# Altium project Motor_Controller_3.PrjPcb
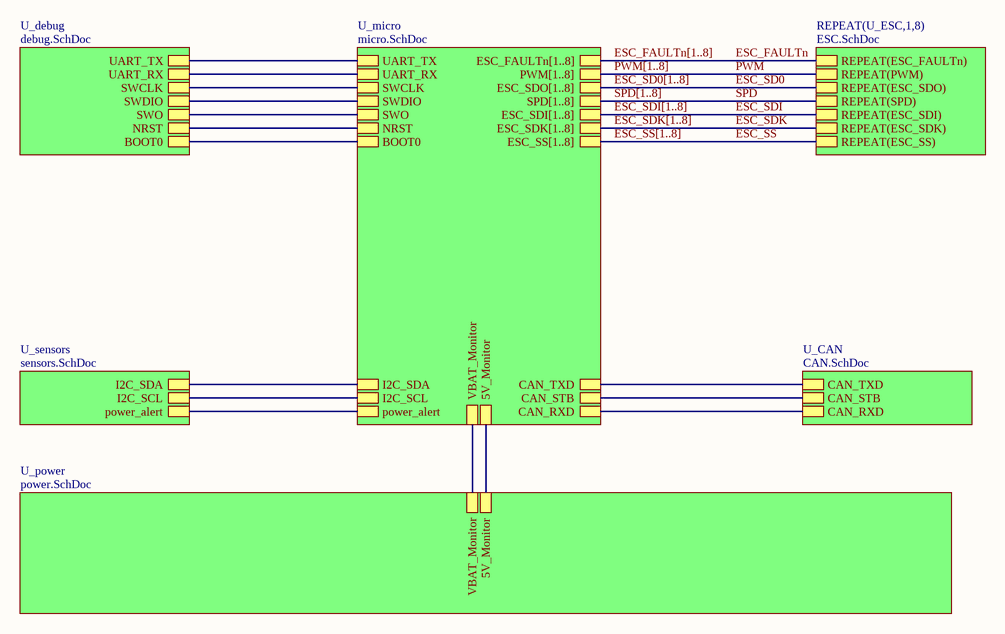
[diagram p0: master.SchDoc]
7 sheets, 320 parts. Net scope: hierarchical (ports join the sheet entries above them; power ports are global).
Board file: motor_controller_3.PcbDoc
Sheets:
  master.SchDoc
    U_CAN = CAN.SchDoc
    U_micro = micro.SchDoc
    U_power = power.SchDoc
    U_sensors = sensors.SchDoc
    U_ESC1 = ESC.SchDoc
    U_ESC2 = ESC.SchDoc
    U_ESC3 = ESC.SchDoc
    U_ESC4 = ESC.SchDoc
    U_ESC5 = ESC.SchDoc
    U_ESC6 = ESC.SchDoc
    U_ESC7 = ESC.SchDoc
    U_ESC8 = ESC.SchDoc
    U_debug = debug.SchDoc

## Sheet master.SchDoc
size A4

### Sub-sheets
REPEAT(U_ESC,1,8) = ESC.SchDoc: REPEAT(ESC_FAULTn), REPEAT(PWM), REPEAT(ESC_SDO), REPEAT(SPD), REPEAT(ESC_SDI), REPEAT(ESC_SDK), REPEAT(ESC_SS)
U_CAN = CAN.SchDoc: CAN_TXD, CAN_STB, CAN_RXD
U_debug = debug.SchDoc: UART_TX, UART_RX, SWCLK, SWDIO, SWO, NRST, BOOT0
U_micro = micro.SchDoc: UART_TX, ESC_SS[1..8], UART_RX, ESC_FAULTn[1..8], SPD[1..8], PWM[1..8], CAN_STB, ESC_SDK[1..8], ESC_SDI[1..8], I2C_SDA, I2C_SCL, CAN_TXD, CAN_RXD, ESC_SDO[1..8], SWO, SWCLK, SWDIO, NRST, BOOT0, power_alert, VBAT_Monitor, 5V_Monitor
U_power = power.SchDoc: VBAT_Monitor, 5V_Monitor
U_sensors = sensors.SchDoc: I2C_SDA, I2C_SCL, power_alert

### Nets
CAN_RX: sheet U_CAN/CAN_RXD, sheet U_micro/CAN_RXD
CAN_TX: sheet U_CAN/CAN_TXD, sheet U_micro/CAN_TXD
ESC_FAULTn: sheet REPEAT(U_ESC,1,8)/REPEAT(ESC_FAULTn)
ESC_SD0: sheet REPEAT(U_ESC,1,8)/REPEAT(ESC_SDO)
ESC_SDI: sheet REPEAT(U_ESC,1,8)/REPEAT(ESC_SDI)
ESC_SDK: sheet REPEAT(U_ESC,1,8)/REPEAT(ESC_SDK)
ESC_SS: sheet REPEAT(U_ESC,1,8)/REPEAT(ESC_SS)
NRST: sheet U_micro/NRST, sheet U_debug/NRST
PWM: sheet REPEAT(U_ESC,1,8)/REPEAT(PWM)
SCL: sheet U_micro/I2C_SCL, sheet U_sensors/I2C_SCL
SDA: sheet U_micro/I2C_SDA, sheet U_sensors/I2C_SDA
SPD: sheet REPEAT(U_ESC,1,8)/REPEAT(SPD)
SWCLK: sheet U_micro/SWCLK, sheet U_debug/SWCLK
SWDIO: sheet U_micro/SWDIO, sheet U_debug/SWDIO
SWO: sheet U_micro/SWO, sheet U_debug/SWO
NetCN3_3: sheet U_micro/UART_TX, sheet U_debug/UART_TX
NetCN3_4: sheet U_micro/UART_RX, sheet U_debug/UART_RX
NetJP3_2: sheet U_micro/BOOT0, sheet U_debug/BOOT0
NetR25_1: sheet U_micro/power_alert, sheet U_sensors/power_alert
NetR31_1: sheet U_micro/VBAT_Monitor, sheet U_power/VBAT_Monitor
NetR32_2: sheet U_micro/5V_Monitor, sheet U_power/5V_Monitor
NetU1_69: sheet U_CAN/CAN_STB, sheet U_micro/CAN_STB

### Buses and harness runs
bus ESC_FAULTn[1..8] = sheet U_micro/ESC_FAULTn[1..8]
bus ESC_SD0[1..8] = sheet U_micro/ESC_SDO[1..8]
bus ESC_SDI[1..8] = sheet U_micro/ESC_SDI[1..8]
bus ESC_SDK[1..8] = sheet U_micro/ESC_SDK[1..8]
bus ESC_SS[1..8] = sheet U_micro/ESC_SS[1..8]
bus PWM[1..8] = sheet U_micro/PWM[1..8]
bus SPD[1..8] = sheet U_micro/SPD[1..8]

## Sheet CAN.SchDoc
size A4
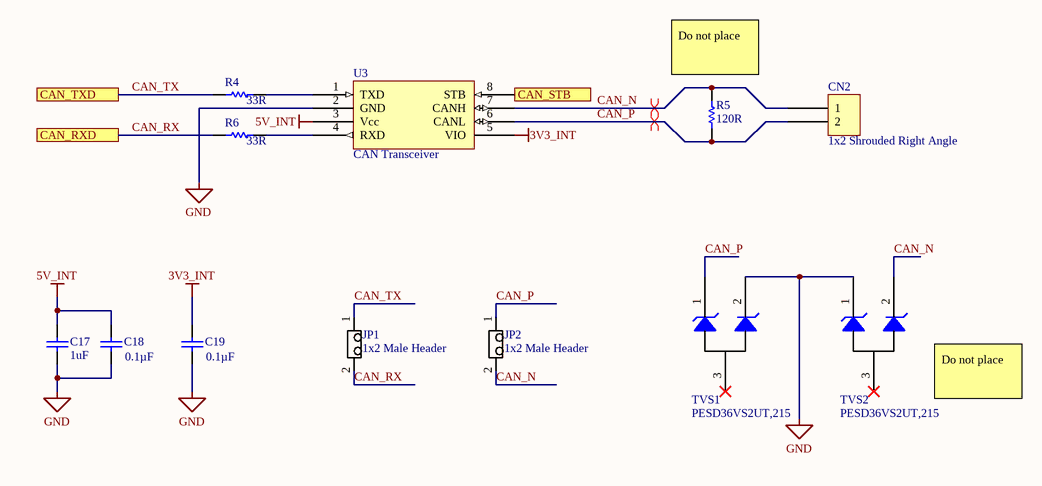
[diagram p1: CAN.SchDoc]

### Parts
C17  Capacitance: 1uF  [0803 CAP]  (hidden comment: CL21B105KBFNNNG)
C18  value 0.1µF  [CAPC2012N(0805")]  (hidden comment: 0.1uF 50V 0805 SMD, Ceramic)
C19  value 0.1µF  [CAPC2012N(0805")]  (hidden comment: 0.1uF 50V 0805 SMD, Ceramic)
CN2  1x2 Shrouded Right Angle  [2X1 Female Header]
JP1  1x2 Male Header  [2X1 Males Header]
JP2  1x2 Male Header  [2X1 Males Header]
R4  33R  [RESC1608X55X25LL10T15]
R5  120R  [RESC1608X55X25LL10T15]
R6  33R  [RESC1608X55X25LL10T15]
TVS1  PESD36VS2UT,215  [SOT95P245X110-3N]
TVS2  PESD36VS2UT,215  [SOT95P245X110-3N]
U3  CAN Transceiver  [8-SOIC]

### Ports
CAN_RXD, CAN_STB, CAN_TXD

### Nets
3V3_INT: C19.2(Cathode) U3.5(VIO)
5V_INT: C17.2 C18.2(Cathode) U3.3(Vcc)
GND: C17.1 C18.1(Anode) C19.1(Anode) TVS1.2(Cathode_2) TVS2.1(Cathode_1) U3.2(GND)
CAN_N: CN2.1 JP2.2 R5.2 TVS2.2(Cathode_2) U3.7(CANH)
CAN_P: CN2.2 JP2.1 R5.1 TVS1.1(Cathode_1) U3.6(CANL)
CAN_RX: JP1.2 R6.1 ; port CAN_RXD
CAN_TX: JP1.1 R4.1 ; port CAN_TXD
NetR4_2: R4.2 U3.1(TXD)
NetR6_2: R6.2 U3.4(RXD)
NetU1_69: U3.8(STB) ; port CAN_STB

Not connected (* = marked no-connect by the designer): TVS1 3(Common_Anode); TVS2 3(Common_Anode)

### Layout directives
differential pair; differential pair; differential pair; differential pair; differential pair: CAN_N
differential pair: CAN_P

### Notes on the sheet
- (near R5) Do not place
- (near TVS2) Do not place

### Library data of the parts
C17 = CMP-00005-3: SAMSUNG ELECTRO-MECHANICS - CL21B105KBFNNNG - MLCC CAPACITORS; Tolerance: 10%; Voltage Rating: 50V; Material: Ceramic; Dielectric: X7R; Case/Package: 0805; Contact Plating: Tin; Max Operating Temperature: 125°C; Termination: Wraparound; Package Quantity: 3000; Depth: 1.25mm; Mount: Surface Mount; Min Operating Temperature: -55°C; Thickness: 0.053inch; Packaging: Tape and Reel; Voltage: 50V; Case Code (Metric): 2012; Length: 2mm; Case Code (Imperial): 0805; Width: 0.049inch
C18 C19 = CMP-006-0006-1: Capacitor, Ceramic, 50V, +/-5%, 0805 SMD, X7R; Source: AUVic_Schematic_Library_Capacitors.SchLib; Component Type: Standard; PackageDescription: Chip Capacitor; Publisher: AUVic; Pin Count: 2; Published: 2016-03-16; Design Item ID: 0.1uF 50V 0805 SMD, Ceramic
CN2 = CMP-00010-3: 02 MTE HDR SRRA LATCH; Connector Type: Plug,Header,Pin; Backwall/Post Interruptions: No (Without); Pitch: 2.54mm; Approvals: CSA; Gender: Male; Contact Resistance: 15mR; PCB Thickness: 0.062inch; Contact Current Rating: 3A; Contact Retention: Yes (With); Number of Contacts: 2; PCB Mount Retention: Without; Insulation Resistance: 5GR; Row Spacing: 0.1inch; Tail Length: 3.3mm; Contact Plating: Gold,Tin,Matte; ELV: Compliant; Height: 13.59mm; Package Quantity: 68; Current Rating: 3A; Mount: Through Hole; Number of Rows: 1; Contact Material: Brass; Max Operating Temperature: 105°C; Lead Free: Lead Free; Mating Alignment: Yes (With); Min Operating Temperature: -65°C; Flammability Rating: UL94 V-0; Mating Retention: Yes (With); Color: Black; Number of Positions: 2; REACH SVHC: Unknown; Contact Mating Length: 0.23inch; Orientation: Right Angle; Packaging: Rail/Tube; Termination: Crimp; PCB Mount Alignment: No (Without); Contact Shape: Square; PCB Mounting Orientation: Right Angle; Housing Color: Black; Depth: 13.59mm; Length: 7.62mm; Contact Gender: Male; Strain Relief: No (Without); Housing Material: Thermoplastic
JP1 JP2 = CMP-004-0001-1: Made By: Andy Bates; Source: AUVic_Schematic_Library_Connectors.SchLib; Pin Count: 2; Design Item ID: 1x2 Male Header; Component Type: Standard
R4 R6 = CMP-00060-1: Res Thick Film 0603 33 Ohm 1% 1/10W +/-100ppm/ßC Molded SMD Paper T/R; Max Power Dissipation: 100mW; Voltage Rating: 75V; Voltage Rating (DC): 50V; Temperature Coefficient: 100ppm/°C; Depth: 0.8mm; Military Standard: Not; Min Operating Temperature: -55°C; Termination: SMD/SMT; Weight: 7.1E-05oz; Number of Terminations: 2; Height: 0.45mm; Power Rating: 100mW; Composition: Thick Film; Length: 1.6mm; Packaging: Tape and Reel; Resistance: 33R; Lead Pitch: 0.3mm; Lead Free: Lead Free; Max Operating Temperature: 155°C; REACH SVHC: No SVHC; Features: Moisture Resistant; Tolerance: 1%; Case/Package: 0603; Package Quantity: 1; Width: 0.8mm; Case Code (Metric): 1608; Number of Pins: 2; Case Code (Imperial): 0603
R5 = CMP-00061-1: Res Thick Film 0603 120 Ohm 1% 0.1W(1/10W) ±100ppm/C Epoxy SMD T/R; Power Rating: 100mW; Voltage Rating (DC): 50V; Temperature Coefficient: 100ppm/°C; Depth: 0.8mm; Max Operating Temperature: 155°C; Case/Package: 0603; Lead Free: Lead Free; Height: 0.022inch; Length: 1.6mm; Case Code (Metric): 1608; Package Quantity: 1; Features: Moisture Resistant; Termination: SMD/SMT; Military Standard: Not; Number of Pins: 2; Width: 0.031inch; REACH SVHC: No SVHC; Max Power Dissipation: 100mW; Min Operating Temperature: -55°C; Resistance: 120R; Packaging: Tape and Reel; Composition: Thick Film; Tolerance: 1%; Voltage Rating: 50V; Number of Terminations: 2; Case Code (Imperial): 0603
TVS1 TVS2 = CMP-058-0000-2: TVS DIODE 36V 60V SOT23; Created By: Miguel Manguerra; Date Created: 2020-05-18; Design Item ID: PESD36VS2UT,215; Component Type: Standard; Pin Count: 3; Source: AUVic_Schematic_Library_Diodes.SchLib
U3 = CMP-032-0000-2: 1/1 Transceiver Half CANbus 8-SO; Data Rate: 1Mbps; Max Supply Voltage: 5.5V; Propagation Delay: 250ns; Number of Transceivers: 1; Nominal Supply Current: 70mA; Min Supply Voltage: 4.5V; Min Operating Temperature: -40°C; Radiation Hardening: No; Packaging: Tape and Reel; Turn-On Delay Time: 250ns; Case/Package: SO; Contact Plating: Gold; Package Quantity: 2500; Number of Pins: 8; Max Supply Current: 70mA; Max Operating Temperature: 150°C; Interface: CAN; Mount: Surface Mount; Lead Free: Lead Free

## Sheet micro.SchDoc
size A4
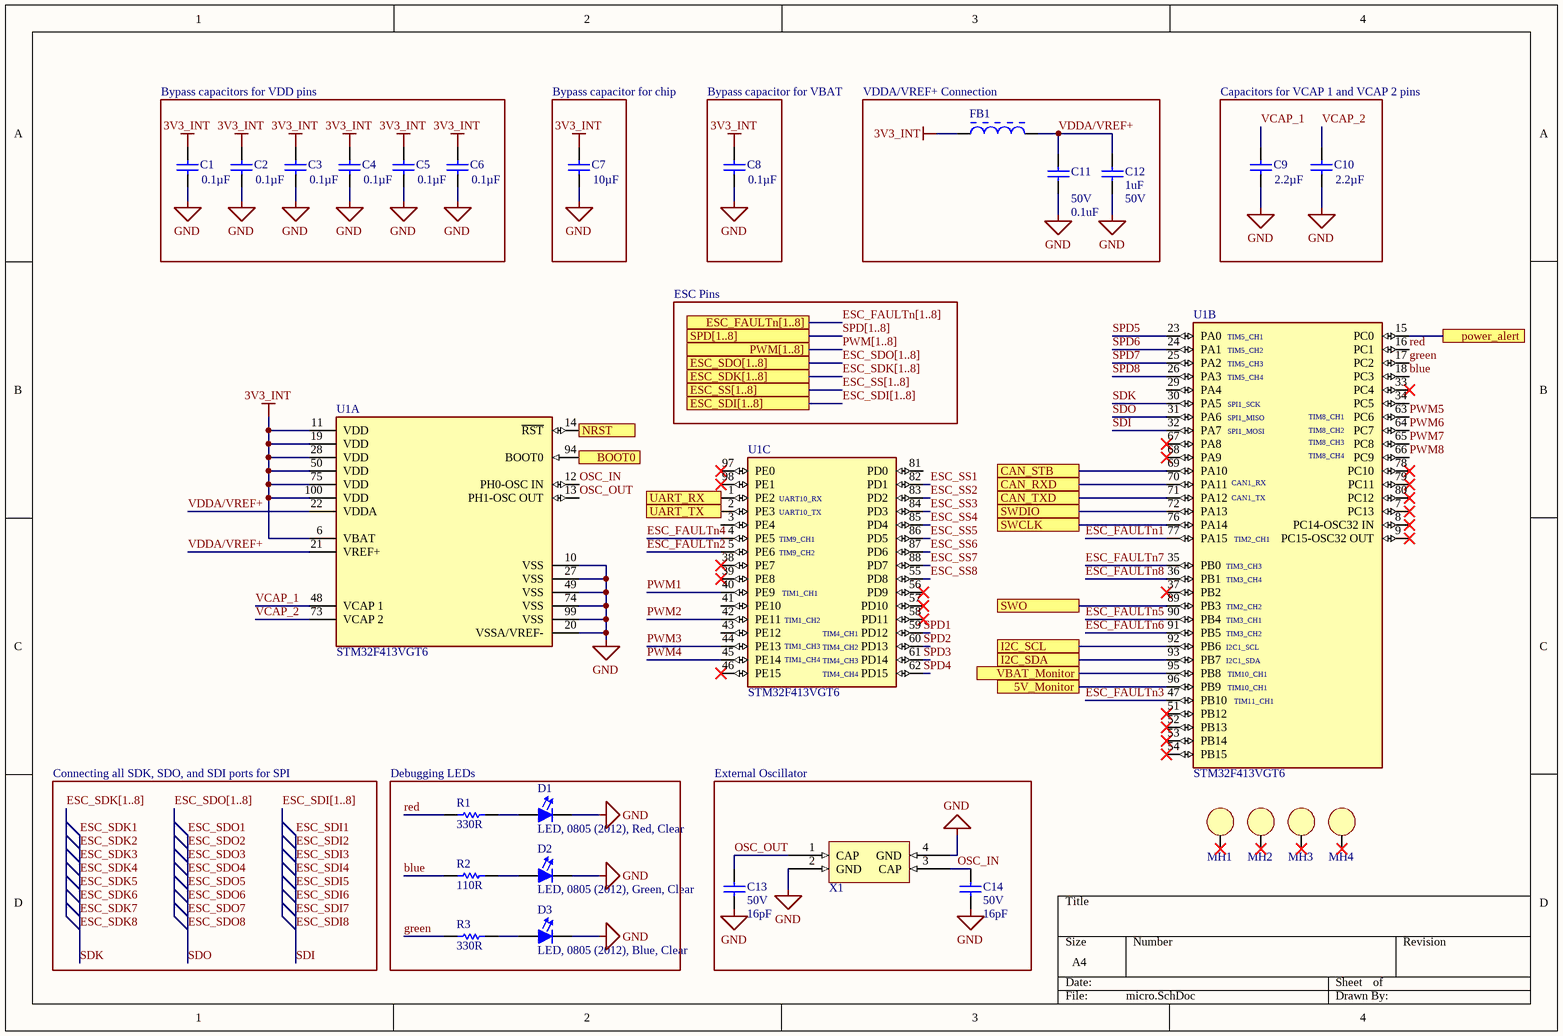
[diagram p2: micro.SchDoc]

### Parts
C1  value 0.1µF  [CAPC1608N(0603")]  (hidden comment: 0.1uF 16V 0603 SMD, Ceramic)
C2  value 0.1µF  [CAPC1608N(0603")]  (hidden comment: 0.1uF 16V 0603 SMD, Ceramic)
C3  value 0.1µF  [CAPC1608N(0603")]  (hidden comment: 0.1uF 16V 0603 SMD, Ceramic)
C4  value 0.1µF  [CAPC1608N(0603")]  (hidden comment: 0.1uF 16V 0603 SMD, Ceramic)
C5  value 0.1µF  [CAPC1608N(0603")]  (hidden comment: 0.1uF 16V 0603 SMD, Ceramic)
C6  value 0.1µF  [CAPC1608N(0603")]  (hidden comment: 0.1uF 16V 0603 SMD, Ceramic)
C7  value 10µF  [CAPC2012N(0805")]  (hidden comment: 10uF 10V 0805 SMD, Ceramic)
C8  value 0.1µF  [CAPC1608N(0603")]  (hidden comment: 0.1uF 16V 0603 SMD, Ceramic)
C9  value 2.2µF  [CAPC1608N(0603")]  (hidden comment: 2.2uF, 50V, 0603 SMD, X5R, Ceramic)
C10  value 2.2µF  [CAPC1608N(0603")]  (hidden comment: 2.2uF, 50V, 0603 SMD, X5R, Ceramic)
C11  Voltage: 50V  Capacitance: 0.1uF  [FP-CL10-0_1-MFG]  (hidden comment: CL10B104JB8NNNC)
C12  Capacitance: 1uF  Voltage: 50V  [0803 CAP]  (hidden comment: CL21B105KBFNNNG)
C13  Voltage: 50V  Capacitance: 16pF  [CAPC1608X90X35LL10T15]  (hidden comment: 16pF Ceramic 50V 5% 0603)
C14  Voltage: 50V  Capacitance: 16pF  [CAPC1608X90X35LL10T15]  (hidden comment: 16pF Ceramic 50V 5% 0603)
D1  LED, 0805 (2012), Red, Clear  [LED0805]
D2  LED, 0805 (2012), Green, Clear  [LED0805]
D3  LED, 0805 (2012), Blue, Clear  [LED0805]
FB1  BLM18AG601SN1D  [MURA-BLM18-F-H1-CHIP-2_V]  (value not drawn)
MH1  Mount_Hole_3mm  [Mount-Hole_3mm]  (value not drawn)
MH2  Mount_Hole_3mm  [Mount-Hole_3mm]  (value not drawn)
MH3  Mount_Hole_3mm  [Mount-Hole_3mm]  (value not drawn)
MH4  Mount_Hole_3mm  [Mount-Hole_3mm]  (value not drawn)
R1  Resistance: 330R  [FP-CRCW0603-e3-IPC_C]  (hidden comment: CRCW0603330RFKEA)
R2  Resistance: 110R  [RESC1608X55X25ML10T15]  (hidden comment: RC0603FR-07110RL)
R3  Resistance: 330R  [FP-CRCW0603-e3-IPC_C]  (hidden comment: CRCW0603330RFKEA)
U1  STM32F413VGT6  [FP-LQFP100-1L-IPC_C]  (parts A,B,C of 3)
X1  CRYSTAL 8.0MHZ 16PF SMD  [QFN250P750X520X140_HS-5M]  (value not drawn)

### Blocks framed on the sheet
Bypass capacitors for VDD pins: C1-C6
Bypass capacitor for chip: C7
Bypass capacitor for VBAT: C8
VDDA/VREF+ Connection: C11 C12 FB1
Capacitors for VCAP 1 and VCAP 2 pins: C9 C10
Debugging LEDs: D1-D3 R1-R3
External Oscillator: C13 C14 X1

### Ports
5V_Monitor, BOOT0, CAN_RXD, CAN_STB, CAN_TXD, ESC_FAULTn[1..8], ESC_SDI[1..8], ESC_SDK[1..8], ESC_SDO[1..8], ESC_SS[1..8], I2C_SCL, I2C_SDA, NRST, power_alert, PWM[1..8], SPD[1..8], SWCLK, SWDIO, SWO, UART_RX, UART_TX, VBAT_Monitor

### Nets
3V3_INT: C1.2(Cathode) C2.2(Cathode) C3.2(Cathode) C4.2(Cathode) C5.2(Cathode) C6.2(Cathode) C7.2(Cathode) C8.2(Cathode) FB1.1 U1.6(VBAT) U1.11(VDD) U1.19(VDD) U1.28(VDD) U1.50(VDD) U1.75(VDD) U1.100(VDD)
GND: C1.1(Anode) C2.1(Anode) C3.1(Anode) C4.1(Anode) C5.1(Anode) C6.1(Anode) C7.1(Anode) C8.1(Anode) C9.1(Anode) C10.1(Anode) C11.2 C12.1 C13.1 C14.1 D1.1(Cathode) D2.1(Cathode) D3.1(Cathode) U1.10(VSS) U1.20(VSSA/VREF-) U1.27(VSS) U1.49(VSS) U1.74(VSS) U1.99(VSS) X1.2(GND) X1.4(GND)
blue: R2.1 U1.18(PC3)
CAN_RX: U1.70(PA11) ; port CAN_RXD
CAN_TX: U1.71(PA12) ; port CAN_TXD
ESC_FAULTn1: U1.77(PA15)
ESC_FAULTn2: U1.5(PE6)
ESC_FAULTn3: U1.47(PB10)
ESC_FAULTn4: U1.4(PE5)
ESC_FAULTn5: U1.90(PB4)
ESC_FAULTn6: U1.91(PB5)
ESC_FAULTn7: U1.35(PB0)
ESC_FAULTn8: U1.36(PB1)
ESC_SDI1: U1.32(PA7)  [also labelled ESC_SDI2, ESC_SDI3, ESC_SDI4, ESC_SDI5, ESC_SDI6, ESC_SDI7, ESC_SDI8, SDI]
ESC_SDK1: U1.30(PA5)  [also labelled ESC_SDK2, ESC_SDK3, ESC_SDK4, ESC_SDK5, ESC_SDK6, ESC_SDK7, ESC_SDK8, SDK]
ESC_SDO1: U1.31(PA6)  [also labelled ESC_SDO2, ESC_SDO3, ESC_SDO4, ESC_SDO5, ESC_SDO6, ESC_SDO7, ESC_SDO8, SDO]  [project net ESC_SD01]
ESC_SS1: U1.82(PD1)
ESC_SS2: U1.83(PD2)
ESC_SS3: U1.84(PD3)
ESC_SS4: U1.85(PD4)
ESC_SS5: U1.86(PD5)
ESC_SS6: U1.87(PD6)
ESC_SS7: U1.88(PD7)
ESC_SS8: U1.55(PD8)
green: R3.1 U1.17(PC2)
NRST: U1.14(~{RST}) ; port NRST
OSC_IN: C14.2 U1.12(PH0-OSC_IN) X1.3(CAP)
OSC_OUT: C13.2 U1.13(PH1-OSC_OUT) X1.1(CAP)
PWM1: U1.40(PE9)
PWM2: U1.42(PE11)
PWM3: U1.44(PE13)
PWM4: U1.45(PE14)
PWM5: U1.63(PC6)
PWM6: U1.64(PC7)
PWM7: U1.65(PC8)
PWM8: U1.66(PC9)
red: R1.1 U1.16(PC1)
SCL: U1.92(PB6) ; port I2C_SCL
SDA: U1.93(PB7) ; port I2C_SDA
SPD1: U1.59(PD12)
SPD2: U1.60(PD13)
SPD3: U1.61(PD14)
SPD4: U1.62(PD15)
SPD5: U1.23(PA0)
SPD6: U1.24(PA1)
SPD7: U1.25(PA2)
SPD8: U1.26(PA3)
SWCLK: U1.76(PA14) ; port SWCLK
SWDIO: U1.72(PA13) ; port SWDIO
SWO: U1.89(PB3) ; port SWO
VCAP_1: C9.2(Cathode) U1.48(VCAP_1)
VCAP_2: C10.2(Cathode) U1.73(VCAP_2)
VDDA/VREF+: C11.1 C12.2 FB1.2 U1.21(VREF+) U1.22(VDDA)
NetCN3_3: U1.2(PE3) ; port UART_TX
NetCN3_4: U1.1(PE2) ; port UART_RX
NetD1_2: D1.2(Anode) R1.2
NetD2_2: D2.2(Anode) R2.2
NetD3_2: D3.2(Anode) R3.2
NetJP3_2: U1.94(BOOT0) ; port BOOT0
NetR25_1: U1.15(PC0) ; port power_alert
NetR31_1: U1.95(PB8) ; port VBAT_Monitor
NetR32_2: U1.96(PB9) ; port 5V_Monitor
NetU1_69: U1.69(PA10) ; port CAN_STB

Not connected (* = marked no-connect by the designer): MH1 1*; MH2 1*; MH3 1*; MH4 1*; U1 3(PE4) 7(PC13)* 8(PC14-OSC32_IN)* 9(PC15-OSC32_OUT)* 29(PA4) 33(PC4)* 34(PC5) 37(PB2)* 38(PE7)* 39(PE8)* 41(PE10) 43(PE12) 46(PE15)* 51(PB12)* 52(PB13)* 53(PB14)* 54(PB15)* 56(PD9)* 57(PD10)* 58(PD11)* 67(PA8)* 68(PA9)* 78(PC10)* 79(PC11)* 80(PC12)* 81(PD0) 97(PE0)* 98(PE1)*

### Buses and harness runs
bus ESC_FAULTn[1..8] = port ESC_FAULTn[1..8]
bus ESC_SDI[1..8]
bus ESC_SDI[1..8] = port ESC_SDI[1..8]
bus ESC_SDK[1..8]
bus ESC_SDK[1..8] = port ESC_SDK[1..8]
bus ESC_SDO[1..8]
bus ESC_SDO[1..8] = port ESC_SDO[1..8]
bus ESC_SS[1..8] = port ESC_SS[1..8]
bus PWM[1..8] = port PWM[1..8]
bus SPD[1..8] = port SPD[1..8]

### Notes on the sheet
- ESC Pins
- (near U1) TIM5_CH1
- (near U1) TIM5_CH2
- (near U1) TIM5_CH3
- (near U1) TIM5_CH4
- (near U1) SPI1_SCK
- (near U1) SPI1_MISO
- (near U1) SPI1_MOSI
- (near U1) TIM8_CH1
- (near U1) TIM8_CH2
- (near U1) TIM8_CH3
- (near U1) UART10_RX
- (near U1) UART10_TX
- (near U1) CAN1_RX
- (near U1) CAN1_TX
- (near U1) TIM8_CH4
- (near U1) TIM9_CH1
- (near U1) TIM9_CH2
- (near U1) TIM3_CH3
- (near U1) TIM3_CH4
- (near U1) TIM2_CH1
- (near U1) TIM1_CH1
- (near U1) TIM1_CH2
- (near U1) TIM1_CH3
- (near U1) TIM4_CH1
- (near U1) TIM4_CH2
- (near U1) TIM2_CH2
- (near U1) TIM3_CH1
- (near U1) TIM3_CH2
- (near U1) I2C1_SCL
- (near U1) TIM1_CH4
- (near U1) TIM4_CH3
- (near U1) TIM4_CH4
- (near U1) I2C1_SDA
- (near U1) TIM10_CH1
- (near U1) TIM11_CH1
- Connecting all SDK, SDO, and SDI ports for SPI

### Library data of the parts
C1-C6 C8 = CMP-006-0005-1: Capacitor, Ceramic, 16V, +/- 10%, 0603 SMD, X7R; Created By: Andy Bates; Published: 16-04-26; PackageDescription: Chip Capacitor; Pin Count: 2; Source: AUVic_Schematic_Library_Capacitors.SchLib; Design Item ID: 0.1uF 16V 0603 SMD, Ceramic; Component Type: Standard; Publisher: AUVic
C7 = CMP-006-0017-1: Capacitor, Ceramic, 10V, +/- 10%, 0805 SMD, X5R; Made By: Andy Bates; Source: AUVic_Schematic_Library_Capacitors.SchLib; Pin Count: 2; PackageDescription: Chip Capacitor; Design Item ID: 10uF 10V 0805 SMD, Ceramic; Component Type: Standard; Publisher: AUVic; Published: 14-06-23
C9 C10 = CMP-006-0030-1: Capacitor, Ceramic, 50V, 10%, 0603 SMD, X5R; Date Created: *; Design Item ID: 2.2uF, 50V, 0603 SMD, X5R, Ceramic; Made By: *; Publisher: AUVic; Source: AUVic_Schematic_Library_Capacitors.SchLib; Pin Count: 2; PackageDescription: Chip Capacitor; Component Type: Standard
C11 = CMP-00000-3: CAP CER 0.1UF 50V X7R 0603; Tolerance: 5%; Material: Ceramic; Case Code (Imperial): 0603; Mount: Surface Mount; Thickness: 0.035inch; Depth: 0.8mm; Packaging: Tape and Reel; Package Quantity: 1; Dielectric: X7R; Height: 0.8mm; Radiation Hardening: No; Max Operating Temperature: 125°C; Voltage Rating: 50V; Case/Package: 0603; Min Operating Temperature: -55°C; Case Code (Metric): 1608; Length: 1.6mm; Contact Plating: Tin; Width: 0.031inch
C12 = CMP-00005-3: SAMSUNG ELECTRO-MECHANICS - CL21B105KBFNNNG - MLCC CAPACITORS; Dielectric: X7R; Tolerance: 10%; Material: Ceramic; Min Operating Temperature: -55°C; Length: 2mm; Termination: Wraparound; Contact Plating: Tin; Package Quantity: 3000; Mount: Surface Mount; Max Operating Temperature: 125°C; Case Code (Imperial): 0805; Thickness: 0.053inch; Case/Package: 0805; Width: 0.049inch; Voltage Rating: 50V; Depth: 1.25mm; Packaging: Tape and Reel; Case Code (Metric): 2012
C13 C14 = CMP-00087-2: Cap Ceramic 16pF 50V C0G 5% SMD 0603 125C Paper T/R; Temperature Coefficient: 30ppm/°C; Termination: SMD/SMT; Voltage Rating: 50V; Dielectric: C0G; Radiation Hardening: No; Voltage Rating (DC): 50V; Max Operating Temperature: 125°C; Height: 0.8mm; Width: 0.8mm; Length: 1.6mm; Package Quantity: 1; Lead Free: Lead Free; Min Operating Temperature: -55°C; Case Code (Metric): 1608; Case/Package: 0603; Tolerance: 5%; Mount: Surface Mount; Thickness: 0.035inch; Case Code (Imperial): 0603; Depth: 0.8mm; Packaging: Tape and Reel
D1 = CMP-057-0011-2: Design Item ID: LED, 0805 (2012), Red, Clear; Colour: Red; Component Type: Standard; Pin Count: 2; Created By: Ashwin Sira; Source: AUVic_Schematic_Library_Diodes.SchLib
D2 = CMP-057-0009-2: Created By: Andy Bates; Pin Count: 2; Design Item ID: LED, 0805 (2012), Green, Clear; Source: AUVic_Schematic_Library_Diodes.SchLib; Component Type: Standard; Colour: Green
D3 = CMP-057-0008-2: Colour: Red; Design Item ID: LED, 0805 (2012), Blue, Clear; Component Type: Standard; Pin Count: 2; Source: AUVic_Schematic_Library_Diodes.SchLib; Created By: Ashwin Sira
FB1 = CMP-00016-1: MURATA - BLM18AG601SN1D - Feritový Korálek, 0603 / 1608, 600 ohm, 500 mA, Série BLM18A, 0.38 ohm, ± 25%; DC Current: 500mA; Impedance: 600R; DC Resistance (DCR): 380mR; Core Material: Ferrite; Shielding: Unshielded; Number of Lines: 1; Test Frequency: 100MHz; Material: Steel,Ferrite; Height: 0.8mm; Depth: 0.8mm; Min Operating Temperature: -55°C; Packaging: Tape and Reel; Weight: 7.1E-05oz; Width: 0.8mm; Military Standard: Not; Max Operating Temperature: 125°C; Max Current Rating: 500mA; Case Code (Metric): 1608; Length: 1.6mm; Case Code (Imperial): 0603; Package Quantity: 1; Max DC Current: 500mA; REACH SVHC: No SVHC; Termination: SMD/SMT; Current Rating: 500mA; Lead Free: Lead Free; Tolerance: 25%; Case/Package: 0603; Number of Pins: 2; Radiation Hardening: No; Frequency: 100MHz; Number of Circuits: 1
MH1-MH4 = CMP-004-0010-4: Mounting hold for M3 hex standoff; Design Item ID: Mount_Hole_3mm; Pin Count: 1; Source: AUVic_Schematic_Library_Connectors.SchLib; Component Type: Standard
R1 R3 = CMP-00067-2: Res Thick Film 0603 330 Ohm 1% 0.1W(1/10W) +/-100ppm/ßC Pad SMD Automotive T/R; Voltage Rating (DC): 75V; Power Rating: 100mW; Temperature Coefficient: 100ppm/°C; Contact Plating: Tin; Package Quantity: 10; Tolerance: 1%; Packaging: Tape and Reel; Case/Package: 0603; Max Operating Temperature: 155°C; Case Code (Metric): 1608; Case Code (Imperial): 0603; Min Operating Temperature: -55°C; Length: 1.55mm; Height: 0.45mm; Lead Free: Lead Free; Termination: SMD/SMT; Voltage Rating: 75V; Composition: Thick Film; Weight: 7.1E-05oz; Military Standard: Not; Max Power Dissipation: 100mW; REACH SVHC: Unknown; Mount: Surface Mount; Depth: 0.85mm; Features: Automotive AEC-Q200; Number of Terminations: 2; Radiation Hardening: No; Width: 0.033inch
R2 = CMP-00069-1: RES SMD 110 OHM 1% 1/10W 0603; Max Power Dissipation: 100mW; Voltage Rating (DC): 50V; Temperature Coefficient: 100ppm/°C; Working Voltage: 75V; Military Standard: Not; Termination: SMD/SMT; Number of Terminations: 2; Features: Moisture Resistant; Min Operating Temperature: -55°C; Power Rating: 100mW; Height: 0.022inch; Package Quantity: 1; Lead Free: Lead Free; Tolerance: 1%; Voltage Rating: 50V; Composition: Thick Film; Case Code (Imperial): 0603; Length: 1.6mm; Packaging: Tape and Reel; Case Code (Metric): 1608; Max Operating Temperature: 155°C; Depth: 0.8mm; Case/Package: 0603; Width: 0.031inch
U1 = CMP-00007-3: IC MCU 32BIT 1MB FLASH 100LQFP; Peripherals: Brown-out Detect/Reset,POR,PWM,WDT,DMA,LCD; Frequency: 100MHz; Number of I/Os: 81; Core Architecture: ARM; Oscillator Type: Internal; Interface: I2C,SPI,USB,IrDA,MMC,SDIO,UART,USART,EBI/EMI; Packaging: Tray; Max Operating Temperature: 85°C; Memory Size: 1MB; Min Operating Temperature: -40°C; Memory Type: FLASH; Case/Package: LQFP
X1 = CMP-00079-3: 8MHz ±30ppm Crystal 16pF 80 Ohms 4-SMD, No Lead; ESR (Equivalent Series Resistance): 80R; Frequency Stability: 50ppm; Case/Package: CSMD; Load Capacitance: 16pF; Number of Pins: 4; Min Operating Temperature: -20°C; Depth: 5.2mm; Max Operating Temperature: 70°C; Length: 7.5mm; Packaging: Tape and Reel; Frequency: 8MHz

## Sheet power.SchDoc
size A4
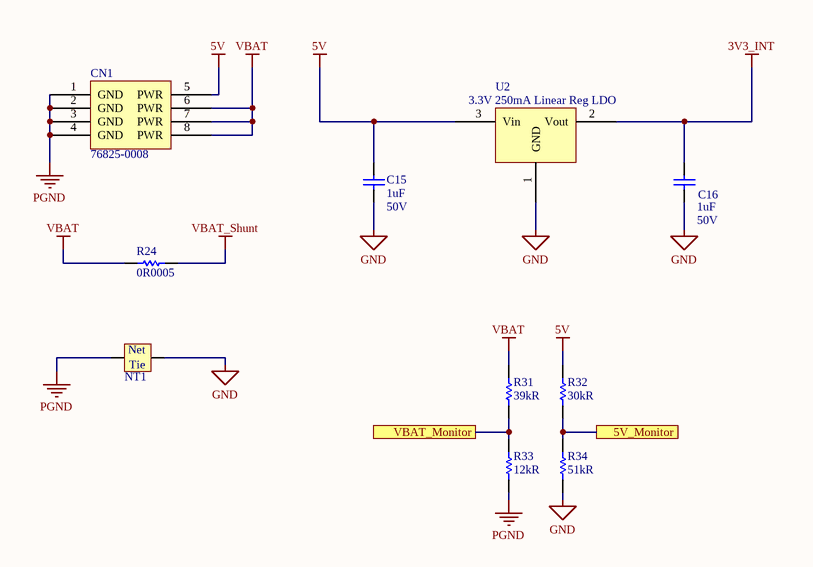
[diagram p3: power.SchDoc]

### Parts
C15  Capacitance: 1uF  Voltage: 50V  [0803 CAP]  (hidden comment: CL21B105KBFNNNG)
C16  Capacitance: 1uF  Voltage: 50V  [0803 CAP]  (hidden comment: CL21B105KBFNNNG)
CN1  76825-0008  [76825-0008-Footprint-1]
NT1  Net Tie, 20x3mm  [NETTIE_20x3mm]  (value not drawn)  (net tie, no BOM)
R24  value 0R0005  [RESC6332N(2512")]  (hidden comment: 0R0005, 1%, 3W, 2512 SMD)
R31  Resistance: 39kR  [FP-CRCW0603-e3-IPC_C]  (hidden comment: CRCW060339K0FKEA)
R32  Resistance: 30kR  [RESC1609X50X30NL10T20]  (hidden comment: CRCW060330K0FKEA)
R33  Resistance: 12kR  [RESC0603(1608)_L]  (hidden comment: 12kR, 1%, 1/10W, 0603)
R34  Resistance: 51kR  [RESC0603(1608)_N]  (hidden comment: CRCW060351K0FKEA)
U2  3.3V 250mA Linear Reg LDO  [SOT95P245X110-3N]

### Ports
5V_Monitor, VBAT_Monitor

### Nets
3V3_INT: C16.2 U2.2(Vout)
5V: C15.2 CN1.5(PWR) R32.1 U2.3(Vin)
GND: C15.1 C16.1 NT1.2 R34.1 U2.1(GND)
PGND: CN1.1(GND) CN1.2(GND) CN1.3(GND) CN1.4(GND) NT1.1 R33.1
VBAT: CN1.6(PWR) CN1.7(PWR) CN1.8(PWR) R24.1 R31.2
VBAT_Shunt: R24.2
NetR31_1: R31.1 R33.2 ; port VBAT_Monitor
NetR32_2: R32.2 R34.2 ; port 5V_Monitor

### Notes on the sheet
- (in symbol CMP-053-0007-2) Net; Tie

### Library data of the parts
C15 = CMP-00005-3: as C12 on sheet micro; Min Operating Temperature: -55°C; Length: 2mm; Termination: Wraparound; Contact Plating: Tin; Package Quantity: 3000; Mount: Surface Mount; Max Operating Temperature: 125°C; Case Code (Imperial): 0805; Thickness: 0.053inch; Case/Package: 0805; Width: 0.049inch; Voltage Rating: 50V; Depth: 1.25mm; Packaging: Tape and Reel; Case Code (Metric): 2012
C16 = CMP-00005-3: SAMSUNG ELECTRO-MECHANICS - CL21B105KBFNNNG - MLCC CAPACITORS; Tolerance: 10%; Material: Ceramic; Dielectric: X7R; Case/Package: 0805; Voltage Rating: 50V; Contact Plating: Tin; Max Operating Temperature: 125°C; Termination: Wraparound; Package Quantity: 3000; Depth: 1.25mm; Mount: Surface Mount; Min Operating Temperature: -55°C; Thickness: 0.053inch; Packaging: Tape and Reel; Case Code (Metric): 2012; Length: 2mm; Case Code (Imperial): 0805; Width: 0.049inch
CN1 = CMP-00051-3: MOLEX         76825-0008.             CONNECTOR, HEADER, 8POS, 2ROW, 5.7MM; Number of Circuits: 8; Gender: Male; Termination: Through Hole; Color: Black; REACH SVHC: Unknown; Pitch: 5.7mm; Number of Rows: 2; Number of Contacts: 8; Mount: Through Hole; Contact Plating: Tin; Contact Material: Copper; Number of Pins: 8; Orientation: Right Angle
NT1 = CMP-053-0007-2: Size: 20mmx3mm; Date Created: 2016-06-17; Source: AUVic_Integrated_Library_Virtual_Components.SchLib; Pin Count: 2; Created By: Ashwin Sira; Design Item ID: Net Tie, 20x3mm; Component Type: Net Tie; Publisher: AUVic
R24 = CMP-047-0003-1: MFG: Riedon; MFG#: CSR2512C0R0005F; Last_Revision_Note: Made; Last_Revision_By: Ashwin Sira; Created On: 2016-04-28; Last_Revision_Date: 2016-04-28; Created By: Ashwin Sira; Component Type: Standard; Design Item ID: 0R0005, 1%, 3W, 2512 SMD; Source: AUVic_Schematic_Library_Resistors.SchLib; Pin Count: 2; Publisher: AUVic
R31 = CMP-00126-2: Resistor; Thick Film; 39 Kilohms; 0.1 W; 1%; SMT; 0603; TCR 37 ppm/DegC; Cut Tape; Max Power Dissipation: 100mW; Voltage Rating: 75V; Temperature Coefficient: 100ppm/°C; Construction: Rectangular; Mount: Surface Mount; Packaging: Tape and Reel; Weight: 7.1E-05oz; Resistor Type: Thick Film; Features: Automotive AEC-Q200; Number of Terminations: 2; Case Code (Metric): 1608; Number of Pins: 2; Case/Package: 0603; Package Quantity: 10; REACH SVHC: Unknown; Max Operating Temperature: 155°C; Termination: SMD/SMT; Contact Plating: Tin; Military Standard: Not; Power Rating: 100mW; Depth: 0.85mm; Radiation Hardening: No; Min Operating Temperature: -55°C; Series: CRCW; Lead Free: Lead Free; Case Code (Imperial): 0603; Width: 0.033inch; Technology: THICK FILM; Tolerance: 1%; Height: 0.45mm; Voltage Rating (DC): 75V; Length: 1.55mm; Size Code: 0603; Resistance Tolerance: 1%
R32 = CMP-00125-1: Resistor SMD 30 kOhm 0603 PU=5000 ST, CRCW060330K0FKEA, Vishay; Max Power Dissipation: 100mW; Temperature Coefficient: 100ppm/°C; Resistance Tolerance: 1%; Voltage Rating: 75V; Min Operating Temperature: -55°C; Radiation Hardening: No; Width: 0.85mm; REACH SVHC: Unknown; Power Rating: 100mW; Max Operating Temperature: 155°C; Case Code (Metric): 1608; Length: 1.55mm; Size Code: 0603; Number of Pins: 2; Contact Plating: Tin; Weight: 7.1E-05oz; Termination: SMD/SMT; Mount: Surface Mount; Packaging: Tape and Reel; Technology: THICK FILM; Features: Automotive AEC-Q200; Resistor Type: Thick Film; Construction: Rectangular; Height: 0.45mm; Series: CRCW; Case/Package: 0603; Number of Terminations: 2; Military Standard: Not; Case Code (Imperial): 0603; Lead Free: Lead Free; Depth: 0.85mm; Package Quantity: 5000; Voltage Rating (DC): 75V; Tolerance: 1%
R33 = CMP-00088-1: TE Connectivity CRG0603 Series Thick Film Surface Mount Resistor 0603 Case 12k 1% 0.1W 100ppm/C; Max Power Dissipation: 100mW; Temperature Coefficient: 100ppm/°C; Number of Terminations: 2; Packaging: Tape and Reel; Width: 0.031inch; Military Standard: Not; Case/Package: 0603; Depth: 0.8mm; Mount: Surface Mount; Tolerance: 1%; Length: 0.063inch; Package Quantity: 5000; Max Operating Temperature: 125°C; Height: 0.022inch; Radiation Hardening: No; Resistor Type: Thick Film; Min Operating Temperature: -55°C
R34 = CMP-00124-1: VISHAY         CRCW060351K0FKEA.            Surface Mount Chip Resistor, Thick Film, AEC-Q200 CRCW Series, 51 kohm, 100 mW,  1%, 75 V; Power Rating: 100mW; Voltage Rating (DC): 75V; Temperature Coefficient: 100ppm/°C; Number of Terminations: 2; Series: CRCW; REACH SVHC: Unknown; Size Code: 0603; Military Standard: Not; Resistance Tolerance: 1%; Height: 0.45mm; Termination: SMD/SMT; Number of Pins: 2; Case Code (Imperial): 0603; Case/Package: 0603; Construction: Rectangular; Weight: 7.1E-05oz; Contact Plating: Tin; Max Operating Temperature: 155°C; Tolerance: 1%; Technology: THICK FILM; Package Quantity: 10; Width: 0.85mm; Packaging: Tape and Reel; Max Power Dissipation: 100mW; Voltage Rating: 75V; Radiation Hardening: No; Resistor Type: Thick Film; Features: Automotive AEC-Q200; Min Operating Temperature: -55°C; Lead Free: Lead Free; Length: 1.55mm; Depth: 0.85mm; Case Code (Metric): 1608
U2 = CMP-00003-1: IC REG LINEAR 3.3V 250MA SOT23-3; Max Input Voltage: 6.6V; Accuracy: 2%; Polarity: Positive; Number of Outputs: 1; Output Type: Fixed; Dropout Voltage: 400mV; Quiescent Current: 1uA; Min Input Voltage: 2.5V; Min Operating Temperature: -40°C; Supplier 1: Digi-Key; Supplier Part Number 1: AP2138N-3.3TRG1; Width: 1.7mm; Length: 3.02mm; Height: 1.3mm; Output Current: 250mA; Created By: Poorna Chander Kalidas; Number of Regulators: 1; Number of Pins: 3; Package Quantity: 3000; Date Created: June 26, 2020; Output Voltage: 3.3V; Max Operating Temperature: 85°C; Max Output Current: 250mA; Weight: 0.000282oz; Packaging: Tape and Reel; Lead Free: Lead Free; Mount: Surface Mount; Case/Package: SOT-23-3

## Sheet sensors.SchDoc
size A4
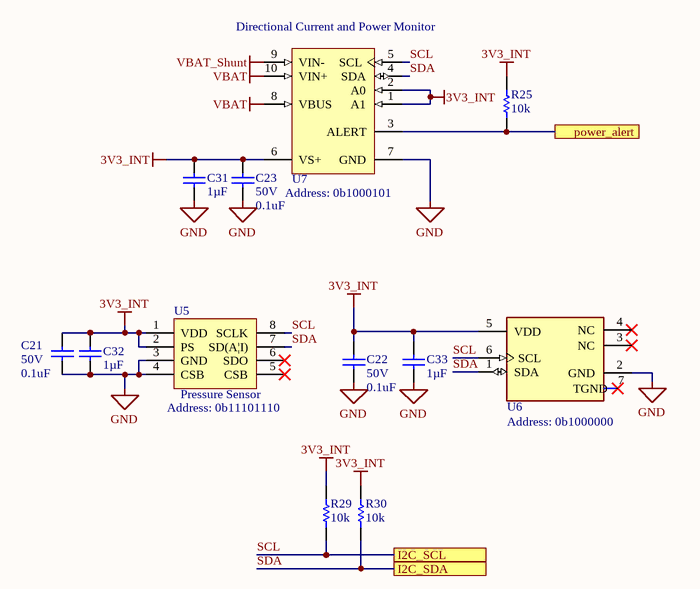
[diagram p4: sensors.SchDoc]

### Parts
C21  Voltage: 50V  Capacitance: 0.1uF  [FP-CL10-0_1-MFG]  (hidden comment: CL10B104JB8NNNC)
C22  Voltage: 50V  Capacitance: 0.1uF  [FP-CL10-0_1-MFG]  (hidden comment: CL10B104JB8NNNC)
C23  Voltage: 50V  Capacitance: 0.1uF  [FP-CL10-0_1-MFG]  (hidden comment: CL10B104JB8NNNC)
C31  value 1µF  [CAPC1608N(0603")]  (hidden comment: 1uF 50V 0603 SMD, Ceramic)
C32  value 1µF  [CAPC1608N(0603")]  (hidden comment: 1uF 50V 0603 SMD, Ceramic)
C33  value 1µF  [CAPC1608N(0603")]  (hidden comment: 1uF 50V 0603 SMD, Ceramic)
R25  value 10k  [RESC1608N(0603")]  (hidden comment: 10kR, 1%, 1/10W, 0603 SMD)
R29  value 10k  [RESC1608N(0603")]  (hidden comment: 10kR, 1%, 1/10W, 0603 SMD)
R30  value 10k  [RESC1608N(0603")]  (hidden comment: 10kR, 1%, 1/10W, 0603 SMD)
U5  Pressure Sensor  [TE Pressure Sensor (MS560702BA03-50)]
U6  Si700XX  [FP-SI7021-A20-GM1R-IPC_B]  (value not drawn)
U7  Directional Current and Power Monitor  [DGS0010A_L]

### Ports
I2C_SCL, I2C_SDA, power_alert

### Nets
3V3_INT: C21.2 C22.2 C23.2 C31.2(Cathode) C32.2(Cathode) C33.2(Cathode) R25.2 R29.2 R30.2 U5.1(VDD) U5.2(PS) U6.5(VDD) U7.1(A1) U7.2(A0) U7.6(VS+)
GND: C21.1 C22.1 C23.1 C31.1(Anode) C32.1(Anode) C33.1(Anode) U5.3(GND) U5.4(CSB) U6.2(GND) U7.7(GND)
VBAT: U7.8(VBUS) U7.10(VIN+)
VBAT_Shunt: U7.9(VIN-)
SCL: R29.1 U5.8(SCLK) U6.6(SCL) U7.5(SCL) ; port I2C_SCL
SDA: R30.1 U5.7(SD(A|I)) U6.1(SDA) U7.4(SDA) ; port I2C_SDA
NetR25_1: R25.1 U7.3(ALERT) ; port power_alert

Not connected (* = marked no-connect by the designer): U5 5(CSB)* 6(SDO)*; U6 3(NC)* 4(NC)* 7(TGND)*

### Notes on the sheet
- Address: 0b1000101
- (near U5) Address: 0b11101110
- (near U6) Address: 0b1000000

### Library data of the parts
C21-C23 = CMP-00000-3: as C11 on sheet micro; Case Code (Imperial): 0603; Mount: Surface Mount; Thickness: 0.035inch; Depth: 0.8mm; Packaging: Tape and Reel; Package Quantity: 1; Dielectric: X7R; Height: 0.8mm; Radiation Hardening: No; Max Operating Temperature: 125°C; Voltage Rating: 50V; Case/Package: 0603; Min Operating Temperature: -55°C; Case Code (Metric): 1608; Length: 1.6mm; Contact Plating: Tin; Width: 0.031inch
C31-C33 = CMP-006-0028-1: Capacitor, Ceramic, 50V, +/- 10%, 0603 SMD, X5R; Design Item ID: 1uF 50V 0603 SMD, Ceramic; Created By: Lyden Smith; PackageDescription: Chip Capacitor; Source: AUVic_Schematic_Library_Capacitors.SchLib; Date Created: 2017-10-26; Pin Count: 2; Component Type: Standard
R25 R29 R30 = CMP-047-0013-1: Owned By: AUVic; Made By: Ashwin Sira; Design Item ID: 10kR, 1%, 1/10W, 0603 SMD; Pin Count: 2; Component Type: Standard; Created On: 14-05-31; Last Edited: 14-05-31; Source: AUVic_Schematic_Library_Resistors.SchLib
U5 = CMP-048-0005-2: 1kPa to 120 kPa; Made by: Andy Bates; Created on: 2017-09-11; Source: AUVic_Schematic_Library_Sensors.SchLib; Component Type: Standard; Design Item ID: MS560702BA03-50 Pressure Sensor; Pin Count: 8
U6 = CMP-048-0009-2: I2C Humidity and Temperature Sensor; Made by: Andy Bates; Pin Count: 4; Design Item ID: Si700XX; Source: AUVic_Schematic_Library_Sensors.SchLib; Component Type: Standard; Created on: 2019/09/08
U7 = CMP-00032-1: Bi Directional Current and Power Monitor 10-Pin VSSOP T/R; Nominal Supply Current: 330uA; Common Mode Rejection Ratio: 140dB; Output Current: 10mA; Accuracy: 0.02%; Input Bias Current: 10uA; Input Offset Voltage (Vos): 2.5uV; Min Supply Voltage: 2.7V; Max Supply Voltage: 5.5V; Mount: Surface Mount; Case/Package: VSSOP; Contact Plating: Gold; Radiation Hardening: No; Packaging: Tape and Reel; Package Quantity: 1; Max Operating Temperature: 125°C; Lead Free: Lead Free; Number of Pins: 10; Min Operating Temperature: -40°C; REACH SVHC: No SVHC

## Sheet ESC.SchDoc
size A4
Used 8 times, as channels U_ESC1, U_ESC2, U_ESC3, U_ESC4, U_ESC5, U_ESC6, U_ESC7, U_ESC8. Parts and nets are listed once, with the designators drawn on the sheet.
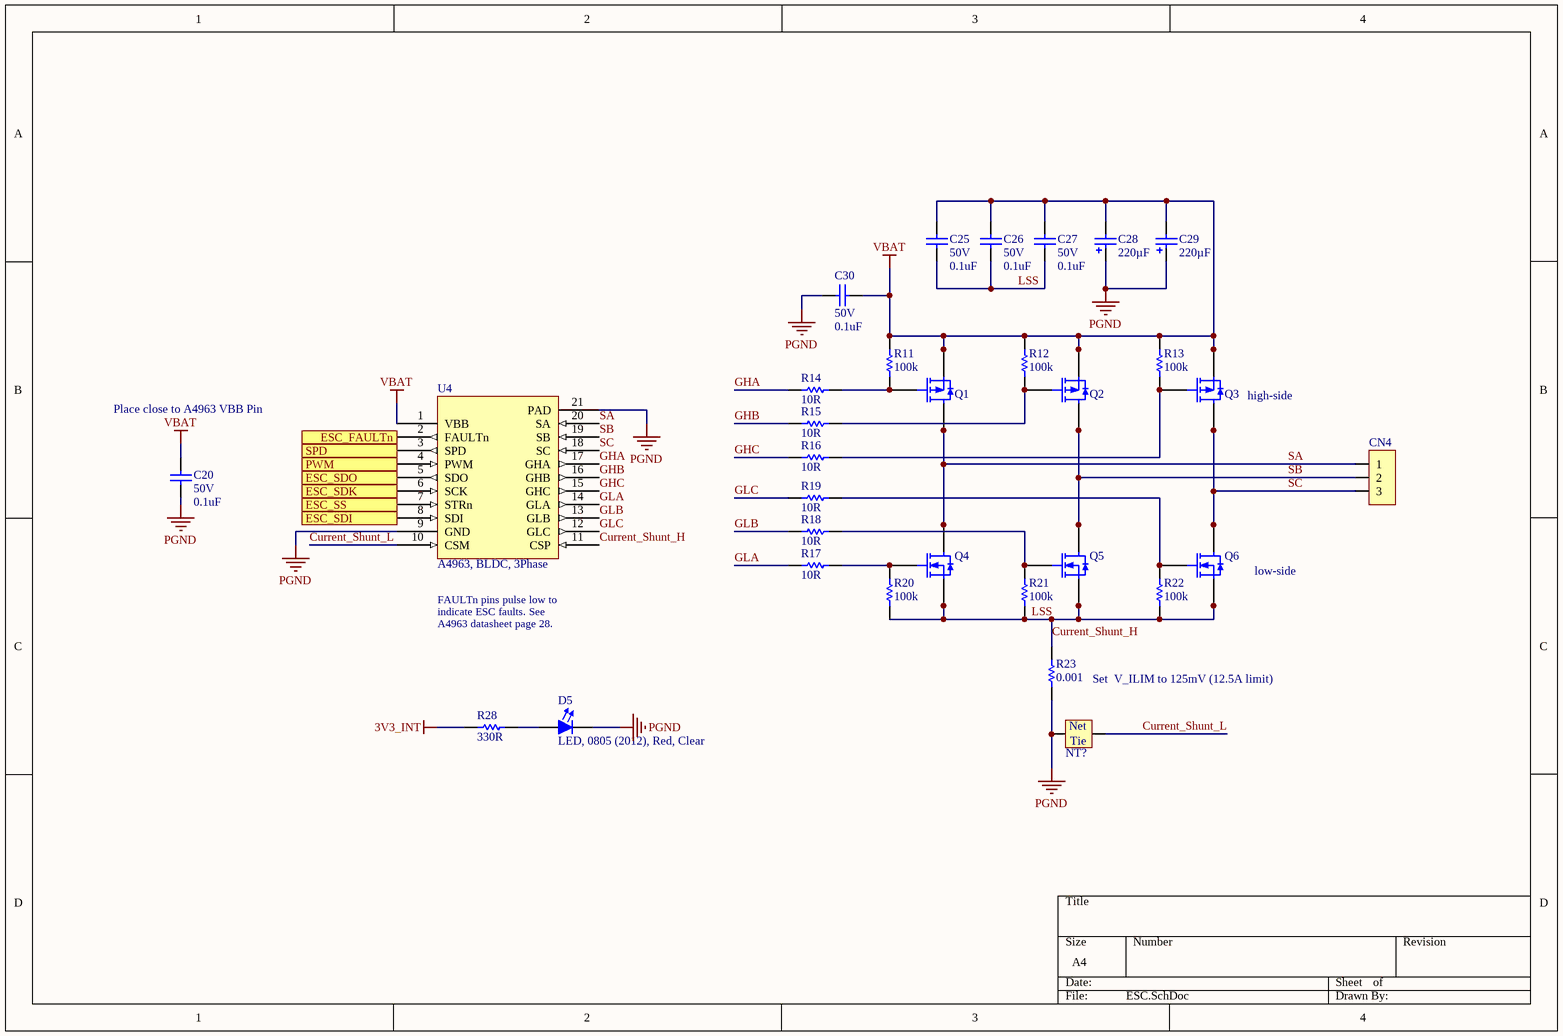
[diagram p5: ESC.SchDoc]

### Parts
C20  Voltage: 50V  Capacitance: 0.1uF  [FP-CL10-0_1-MFG]  (hidden comment: CL10B104JB8NNNC)
C25  Voltage: 50V  Capacitance: 0.1uF  [FP-CL10-0_1-MFG]  (hidden comment: CL10B104JB8NNNC)
C26  Voltage: 50V  Capacitance: 0.1uF  [FP-CL10-0_1-MFG]  (hidden comment: CL10B104JB8NNNC)
C27  Voltage: 50V  Capacitance: 0.1uF  [FP-CL10-0_1-MFG]  (hidden comment: CL10B104JB8NNNC)
C28  value 220µF  [Radial_CAN_8.3mm_10.5mm]  (hidden comment: 220uF, 50V, 20%, Alum, Polarized, SMD)
C29  value 220µF  [Radial_CAN_8.3mm_10.5mm]  (hidden comment: 220uF, 50V, 20%, Alum, Polarized, SMD)
C30  Voltage: 50V  Capacitance: 0.1uF  [FP-CL10-0_1-MFG]  (hidden comment: CL10B104JB8NNNC)
CN4  3x1, Terminal Block, Pitch: 5mm, Screw, THT  [3x1, Terminal Block, Pitch: 5mm, Screw, THT]  (value not drawn)
D5  LED, 0805 (2012), Red, Clear  [LED0805]
NT?  Net Tie, 20mil  [NETTIE_20mil]  (value not drawn)  (net tie, no BOM)
Q1  SI7625DN-T1-GE3  [PowerPAK 1212-8]  (value not drawn)
Q2  SI7625DN-T1-GE3  [PowerPAK 1212-8]  (value not drawn)
Q3  SI7625DN-T1-GE3  [PowerPAK 1212-8]  (value not drawn)
Q4  SIS476DN-T1-GE3  [PowerPAK 1212-8]  (value not drawn)
Q5  SIS476DN-T1-GE3  [PowerPAK 1212-8]  (value not drawn)
Q6  SIS476DN-T1-GE3  [PowerPAK 1212-8]  (value not drawn)
R11  value 100k  [RESC1608N(0603")]  (hidden comment: 100kR, 1%, 1/10W, 0603 SMD)
R12  value 100k  [RESC1608N(0603")]  (hidden comment: 100kR, 1%, 1/10W, 0603 SMD)
R13  value 100k  [RESC1608N(0603")]  (hidden comment: 100kR, 1%, 1/10W, 0603 SMD)
R14  Resistance: 10R  [FP-ERJ3EK-IPC_A]  (hidden comment: ERJ3EKF10R0V)
R15  Resistance: 10R  [FP-ERJ3EK-IPC_A]  (hidden comment: ERJ3EKF10R0V)
R16  Resistance: 10R  [FP-ERJ3EK-IPC_A]  (hidden comment: ERJ3EKF10R0V)
R17  Resistance: 10R  [FP-ERJ3EK-IPC_A]  (hidden comment: ERJ3EKF10R0V)
R18  Resistance: 10R  [FP-ERJ3EK-IPC_A]  (hidden comment: ERJ3EKF10R0V)
R19  Resistance: 10R  [FP-ERJ3EK-IPC_A]  (hidden comment: ERJ3EKF10R0V)
R20  value 100k  [RESC1608N(0603")]  (hidden comment: 100kR, 1%, 1/10W, 0603 SMD)
R21  value 100k  [RESC1608N(0603")]  (hidden comment: 100kR, 1%, 1/10W, 0603 SMD)
R22  value 100k  [RESC1608N(0603")]  (hidden comment: 100kR, 1%, 1/10W, 0603 SMD)
R23  value 0.001  [RESC6332N(2512")]  (hidden comment: CSRL3-0R001F8)
R28  Resistance: 330R  [FP-CRCW0603-e3-IPC_C]  (hidden comment: CRCW0603330RFKEA)
U4  A4963, BLDC, 3Phase  [TSOP65P640X120_HS-21M]

### Ports
ESC_FAULTn, ESC_SDI, ESC_SDK, ESC_SDO, ESC_SS, PWM, SPD

### Nets
3V3_INT: R28.1
PGND: C20.1 C28.1(Anode) C29.1(Anode) C30.1 D5.1(Cathode) NT?.1 R23.1 U4.9(GND) U4.21(PAD)
VBAT: C20.2 C25.2 C26.2 C27.2 C28.2(Cathode) C29.2(Cathode) C30.2 Q1.1(Source) Q1.2(Source) Q1.3(Source) Q2.1(Source) Q2.2(Source) Q2.3(Source) Q3.1(Source) Q3.2(Source) Q3.3(Source) R11.2 R12.2 R13.2 U4.1(VBB)
Current_Shunt_H: C25.1 C26.1 C27.1 Q4.1(Source) Q4.2(Source) Q4.3(Source) Q5.1(Source) Q5.2(Source) Q5.3(Source) Q6.1(Source) Q6.2(Source) Q6.3(Source) R20.1 R21.1 R22.1 R23.2 U4.11(CSP)  [also labelled LSS]
Current_Shunt_L: NT?.2 U4.10(CSM)
ESC_FAULTn: U4.2(FAULTn) ; port ESC_FAULTn
ESC_SDI: U4.8(SDI) ; port ESC_SDI
ESC_SDK: U4.6(SCK) ; port ESC_SDK
ESC_SDO: U4.5(SDO) ; port ESC_SDO
ESC_SS: U4.7(STRn) ; port ESC_SS
GHA: R14.1 U4.17(GHA)
GHB: R15.1 U4.16(GHB)
GHC: R16.1 U4.15(GHC)
GLA: R17.1 U4.14(GLA)
GLB: R18.1 U4.13(GLB)
GLC: R19.1 U4.12(GLC)
PWM: U4.4(PWM) ; port PWM
SA: CN4.1 Q1.5(Drain) Q1.6(Drain) Q1.7(Drain) Q1.8(Drain) Q1.9(Drain) Q4.5(Drain) Q4.6(Drain) Q4.7(Drain) Q4.8(Drain) Q4.9(Drain) U4.20(SA)
SB: CN4.2 Q2.5(Drain) Q2.6(Drain) Q2.7(Drain) Q2.8(Drain) Q2.9(Drain) Q5.5(Drain) Q5.6(Drain) Q5.7(Drain) Q5.8(Drain) Q5.9(Drain) U4.19(SB)
SC: CN4.3 Q3.5(Drain) Q3.6(Drain) Q3.7(Drain) Q3.8(Drain) Q3.9(Drain) Q6.5(Drain) Q6.6(Drain) Q6.7(Drain) Q6.8(Drain) Q6.9(Drain) U4.18(SC)
SPD: U4.3(SPD) ; port SPD
NetD5_2: D5.2(Anode) R28.2
NetQ1_4: Q1.4(Gate) R11.1 R14.2
NetQ2_4: Q2.4(Gate) R12.1 R15.2
NetQ3_4: Q3.4(Gate) R13.1 R16.2
NetQ4_4: Q4.4(Gate) R17.2 R20.2
NetQ5_4: Q5.4(Gate) R18.2 R21.2
NetQ6_4: Q6.4(Gate) R19.2 R22.2

### Channels
U_ESC1: designators end in _U_ESC1; ports ESC_FAULTn=ESC_FAULTn1 ESC_SDI=ESC_SDI1 ESC_SDK=ESC_SDK1 ESC_SDO=ESC_SD01 ESC_SS=ESC_SS1 PWM=PWM1 SPD=SPD1
U_ESC2: designators end in _U_ESC2; ports ESC_FAULTn=ESC_FAULTn2 ESC_SDI=ESC_SDI1 ESC_SDK=ESC_SDK1 ESC_SDO=ESC_SD01 ESC_SS=ESC_SS2 PWM=PWM2 SPD=SPD2
U_ESC3: designators end in _U_ESC3; ports ESC_FAULTn=ESC_FAULTn3 ESC_SDI=ESC_SDI1 ESC_SDK=ESC_SDK1 ESC_SDO=ESC_SD01 ESC_SS=ESC_SS3 PWM=PWM3 SPD=SPD3
U_ESC4: designators end in _U_ESC4; ports ESC_FAULTn=ESC_FAULTn4 ESC_SDI=ESC_SDI1 ESC_SDK=ESC_SDK1 ESC_SDO=ESC_SD01 ESC_SS=ESC_SS4 PWM=PWM4 SPD=SPD4
U_ESC5: designators end in _U_ESC5; ports ESC_FAULTn=ESC_FAULTn5 ESC_SDI=ESC_SDI1 ESC_SDK=ESC_SDK1 ESC_SDO=ESC_SD01 ESC_SS=ESC_SS5 PWM=PWM5 SPD=SPD5
U_ESC6: designators end in _U_ESC6; ports ESC_FAULTn=ESC_FAULTn6 ESC_SDI=ESC_SDI1 ESC_SDK=ESC_SDK1 ESC_SDO=ESC_SD01 ESC_SS=ESC_SS6 PWM=PWM6 SPD=SPD6
U_ESC7: designators end in _U_ESC7; ports ESC_FAULTn=ESC_FAULTn7 ESC_SDI=ESC_SDI1 ESC_SDK=ESC_SDK1 ESC_SDO=ESC_SD01 ESC_SS=ESC_SS7 PWM=PWM7 SPD=SPD7
U_ESC8: designators end in _U_ESC8; ports ESC_FAULTn=ESC_FAULTn8 ESC_SDI=ESC_SDI1 ESC_SDK=ESC_SDK1 ESC_SDO=ESC_SD01 ESC_SS=ESC_SS8 PWM=PWM8 SPD=SPD8

### Notes on the sheet
- Place close to A4963 VBB Pin
- (near Q3) high-side
- (near Q6) low-side
- (near U4) FAULTn pins pulse low to indicate ESC faults. See A4963 datasheet page 28.
- Set  V_ILIM to 125mV (12.5A limit)
- (in symbol CMP-053-0006-1) Net; Tie

### Library data of the parts
C20 C25-C27 C30 = CMP-00000-3: as C11 on sheet micro; Case Code (Imperial): 0603; Mount: Surface Mount; Thickness: 0.035inch; Depth: 0.8mm; Packaging: Tape and Reel; Package Quantity: 1; Dielectric: X7R; Height: 0.8mm; Radiation Hardening: No; Max Operating Temperature: 125°C; Voltage Rating: 50V; Case/Package: 0603; Min Operating Temperature: -55°C; Case Code (Metric): 1608; Length: 1.6mm; Contact Plating: Tin; Width: 0.031inch
C28 C29 = CMP-006-0034-1: Capacitor, Polarized, Aluminum, 50V; Pin Count: 2; Component Type: Standard; Publisher: AUVic; Source: AUVic_Schematic_Library_Capacitors.SchLib; Design Item ID: 220uF, 50V, 20%, Alum, Polarized, SMD; Date Created: 2016-06-25; Created By: Ashwin Sira; PackageDescription: Can
CN4 = CMP-005-0011-1: Source: AUVic_Schematic_Library_Connectors.SchLib; Last Updated: *; Publisher: AUVic, Ashwin Sira; Date Published: 2014-06-03; Component Type: Standard; Reviewed By: *; Design Item ID: 3x1, Terminal Block, Pitch: 5mm, Screw, THT; Pin Count: 3
D5 = CMP-057-0011-2: Design Item ID: LED, 0805 (2012), Red, Clear; Colour: Red; Component Type: Standard; Pin Count: 2; Created By: Ashwin Sira; Source: AUVic_Schematic_Library_Diodes.SchLib
NT? = CMP-053-0006-1: Net Tie, 20mil by 20mil; Size: 0.254mm x 0.508mm; Design Item ID: Net Tie, 20mil; Publisher: AUVic; Pin Count: 2; Source: AUVic_Integrated_Library_Virtual_Components.SchLib; Created By: Ashwin Sira; Date Created: 2016-06-17; Component Type: Net Tie
Q1-Q3 = CMP-052-0024-1: P-Channel 30V 35A (Tc) 3.7W (Ta), 52W (Tc) Surface Mount PowerPAK® 1212-8; Source: AUVic_Schematic_Library_Transistors.SchLib; Component Type: Standard; Created By: Poorna Chander Kalidas; Design Item ID: SI7625DN-T1-GE3; Pin Count: 9
Q4-Q6 = CMP-052-0025-1: N-Channel 30V 40A (Tc) 3.7W (Ta), 52W (Tc) Surface Mount PowerPAK® 1212-8; Design Item ID: SIS476DN-T1-GE3; ComponentLink1URL: https://www.digikey.ca/product-detail/en/diodes-incorporated/DMN3023L-7/DMN3023L-7DICT-ND/5453155; Source: AUVic_Schematic_Library_Transistors.SchLib; ComponentLink1Description: Digi-Key; Pin Count: 9; Created By: Poorna Chander Kalidas; Component Type: Standard
R11-R13 R20-R22 = CMP-047-0010-1: Made By: Andy Bates; Owned By: AUVic; Component Type: Standard; Pin Count: 2; Design Item ID: 100kR, 1%, 1/10W, 0603 SMD; Source: AUVic_Schematic_Library_Resistors.SchLib; Last Edited: 14-06-30; Created On: 14-06-30
R14-R19 = CMP-00034-2: PANASONIC - ERJ3EKF10R0V - SMD Chip Resistor, 0603 [1608 Metric], 10 ohm, ERJ3EK Series, 75 V, Thick Film, 100 mW; Temperature Coefficient: 100ppm/°C; Tolerance: 1%; Max Power Dissipation: 100mW; Voltage Rating (DC): 75V; Package Quantity: 5000; Case Code (Imperial): 0603; Military Standard: Not; Depth: 0.8mm; Number of Terminations: 2; Working Voltage: 75V; Min Operating Temperature: -55°C; Width: 0.8mm; Composition: Thick Film; Packaging: Tape and Reel; Power Rating: 100mW; REACH SVHC: No SVHC; Max Operating Temperature: 155°C; Case Code (Metric): 1608; Features: Automotive AEC-Q200; Case/Package: 0603; Length: 1.6mm; Number of Pins: 2; Lead Free: Lead Free; Height: 0.45mm; Voltage Rating: 75V; Contact Plating: Tin; Termination: SMD/SMT; Mount: Surface Mount; Radiation Hardening: No
R23 = CMP-009-00000-2: Res 0.001 Ohm 1% 3W 2512
R28 = CMP-00067-2: as R1 on sheet micro; Contact Plating: Tin; Package Quantity: 10; Tolerance: 1%; Packaging: Tape and Reel; Case/Package: 0603; Max Operating Temperature: 155°C; Case Code (Metric): 1608; Case Code (Imperial): 0603; Min Operating Temperature: -55°C; Length: 1.55mm; Height: 0.45mm; Lead Free: Lead Free; Termination: SMD/SMT; Voltage Rating: 75V; Composition: Thick Film; Weight: 7.1E-05oz; Military Standard: Not; Max Power Dissipation: 100mW; REACH SVHC: Unknown; Mount: Surface Mount; Depth: 0.85mm; Features: Automotive AEC-Q200; Number of Terminations: 2; Radiation Hardening: No; Width: 0.033inch
U4 = CMP-041-0002-1: A4963, BLDC, 3 Phase, Sensorless; Pin Count: 21; Component Type: Standard; Source: AUVic_Schematic_Library_Motor_Controllers.SchLib; Created By: Poorna Chander Kalidas; Design Item ID: A4963, BLDC, 3Phase

## Sheet debug.SchDoc
size A4
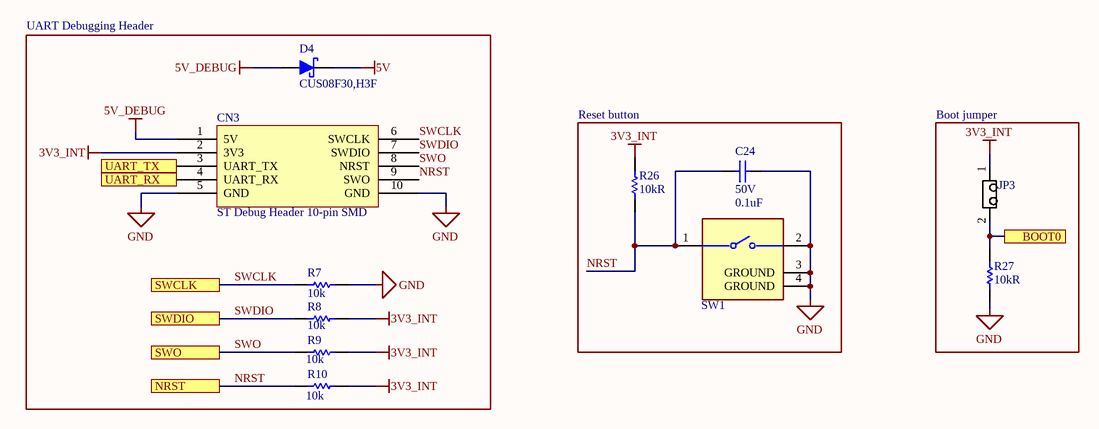
[diagram p6: debug.SchDoc]

### Parts
C24  Voltage: 50V  Capacitance: 0.1uF  [FP-CL10-0_1-MFG]  (hidden comment: CL10B104JB8NNNC)
CN3  ST Debug Header 10-pin SMD  [ST Debug Header 10-pin SMD-Footprint-1]
D4  CUS08F30,H3F  [SC-76]
JP3  1x2 Male Header  [2X1 Males Header]  (value not drawn)
R7  value 10k  [RESC1608N(0603")]  (hidden comment: 10kR, 1%, 1/10W, 0603 SMD)
R8  value 10k  [RESC1608N(0603")]  (hidden comment: 10kR, 1%, 1/10W, 0603 SMD)
R9  value 10k  [RESC1608N(0603")]  (hidden comment: 10kR, 1%, 1/10W, 0603 SMD)
R10  value 10k  [RESC1608N(0603")]  (hidden comment: 10kR, 1%, 1/10W, 0603 SMD)
R26  10kR  [RESC1608N(0603")]
R27  10kR  [RESC1608N(0603")]
SW1  PTS636SKG25SMTRLFS  [FP-PTS636_SKG25_SMTR_LFS-MFG]  (value not drawn)

### Blocks framed on the sheet
UART Debugging Header: CN3 D4 R7-R10
Reset button: C24 R26 SW1
Boot jumper: JP3 R27

### Ports
BOOT0, NRST, SWCLK, SWDIO, SWO, UART_RX, UART_TX

### Nets
3V3_INT: CN3.2(3V3) JP3.1 R8.2 R9.2 R10.2 R26.1
5V: D4.K(Cathode)
5V_DEBUG: CN3.1(5V) D4.A(Anode)
GND: C24.1 CN3.5(GND) CN3.10(GND) R7.2 R27.2 SW1.2 SW1.3(GROUND) SW1.4(GROUND)
NRST: C24.2 CN3.9(SWO) R10.1 R26.2 SW1.1 ; port NRST
SWCLK: CN3.6(SWCLK) R7.1 ; port SWCLK
SWDIO: CN3.7(SWDIO) R8.1 ; port SWDIO
SWO: CN3.8(NRST) R9.1 ; port SWO
NetCN3_3: CN3.3(UART_TX) ; port UART_TX
NetCN3_4: CN3.4(UART_RX) ; port UART_RX
NetJP3_2: JP3.2 R27.1 ; port BOOT0

### Library data of the parts
C24 = CMP-00000-3: as C11 on sheet micro; Case Code (Imperial): 0603; Mount: Surface Mount; Thickness: 0.035inch; Depth: 0.8mm; Packaging: Tape and Reel; Package Quantity: 1; Dielectric: X7R; Height: 0.8mm; Radiation Hardening: No; Max Operating Temperature: 125°C; Voltage Rating: 50V; Case/Package: 0603; Min Operating Temperature: -55°C; Case Code (Metric): 1608; Length: 1.6mm; Contact Plating: Tin; Width: 0.031inch
CN3 = CMP-00013-1: CONN HEADER SMD 10POS 2.54MM; Row Spacing: 0.1inch; Connector Type: Male Pin; Number of Positions: 10; Mount: Surface Mount; Package Quantity: 1; Packaging: Rail/Tube; Termination: Solder; Contact Plating: Gold; Number of Rows: 2; Lead Free: Lead Free; Pitch: 0.1inch; Color: Black
D4 = CMP-057-0000-2: Diode Schottky 30V 800mA Surface Mount USC; Peak Non-Repetitive Surge Current: 5A; Element Configuration: Single; Peak Reverse Current: 50uA; Packaging: Tape and Reel; Mount: Surface Mount; Average Rectified Current: 800mA; Case/Package: SOD; Max Reverse Voltage (DC): 30V; Min Operating Temperature: -55°C; Contact Plating: Tin,Silver; Max Repetitive Reverse Voltage (Vrrm): 30V; Number of Pins: 2; Max Operating Temperature: 125°C
JP3 = CMP-004-0001-1: Made By: Andy Bates; Source: AUVic_Schematic_Library_Connectors.SchLib; Pin Count: 2; Design Item ID: 1x2 Male Header; Component Type: Standard
R7-R10 = CMP-047-0013-1: Owned By: AUVic; Made By: Ashwin Sira; Design Item ID: 10kR, 1%, 1/10W, 0603 SMD; Pin Count: 2; Component Type: Standard; Created On: 14-05-31; Last Edited: 14-05-31; Source: AUVic_Schematic_Library_Resistors.SchLib
R26 R27 = CMP-047-0013-1: 10kR, 1%, 1/10W, 0603 SMD; Owned By: AUVic; Made By: Ashwin Sira; Value: 10k; Design Item ID: 10kR; Pin Count: 2; Component Type: Standard; Created On: 14-05-31; Last Edited: 14-05-31; Source: AUVic_Schematic_Library_Resistors.SchLib
SW1 = CMP-00104-1: PTS636 Series SPST-NO Off-Mom 250 gf Top Actuated Gull Wing SMT Tactile Switch; Voltage Rating (DC): 12V; Throw Configuration: SPST; Current Rating: 50mA; Switch Function: Off-Mom

## Nets that join several sheets
3V3_INT: CAN (C19.2 U3.5), micro (16 pins), power (C16.2 U2.2), sensors (15 pins), U_ESC1 (R28_U_ESC1.1), U_ESC2 (R28_U_ESC2.1), U_ESC3 (R28_U_ESC3.1), U_ESC4 (R28_U_ESC4.1), U_ESC5 (R28_U_ESC5.1), U_ESC6 (R28_U_ESC6.1), U_ESC7 (R28_U_ESC7.1), U_ESC8 (R28_U_ESC8.1), debug (6 pins)
5V: power (C15.2 CN1.5 R32.1 U2.3), debug (D4.K)
GND: CAN (6 pins), micro (25 pins), power (5 pins), sensors (10 pins), debug (8 pins)
PGND: power (6 pins), U_ESC1 (9 pins), U_ESC2 (9 pins), U_ESC3 (9 pins), U_ESC4 (9 pins), U_ESC5 (9 pins), U_ESC6 (9 pins), U_ESC7 (9 pins), U_ESC8 (9 pins)
VBAT: power (5 pins), sensors (U7.8 U7.10), U_ESC1 (20 pins), U_ESC2 (20 pins), U_ESC3 (20 pins), U_ESC4 (20 pins), U_ESC5 (20 pins), U_ESC6 (20 pins), U_ESC7 (20 pins), U_ESC8 (20 pins)
VBAT_Shunt: power (R24.2), sensors (U7.9)
CAN_RX: CAN (JP1.2 R6.1), micro (U1.70)
CAN_TX: CAN (JP1.1 R4.1), micro (U1.71)
ESC_FAULTn1: micro (U1.77), U_ESC1 (U4_U_ESC1.2)
ESC_FAULTn2: micro (U1.5), U_ESC2 (U4_U_ESC2.2)
ESC_FAULTn3: micro (U1.47), U_ESC3 (U4_U_ESC3.2)
ESC_FAULTn4: micro (U1.4), U_ESC4 (U4_U_ESC4.2)
ESC_FAULTn5: micro (U1.90), U_ESC5 (U4_U_ESC5.2)
ESC_FAULTn6: micro (U1.91), U_ESC6 (U4_U_ESC6.2)
ESC_FAULTn7: micro (U1.35), U_ESC7 (U4_U_ESC7.2)
ESC_FAULTn8: micro (U1.36), U_ESC8 (U4_U_ESC8.2)
ESC_SD01: micro (U1.31), U_ESC1 (U4_U_ESC1.5), U_ESC2 (U4_U_ESC2.5), U_ESC3 (U4_U_ESC3.5), U_ESC4 (U4_U_ESC4.5), U_ESC5 (U4_U_ESC5.5), U_ESC6 (U4_U_ESC6.5), U_ESC7 (U4_U_ESC7.5), U_ESC8 (U4_U_ESC8.5)
ESC_SDI1: micro (U1.32), U_ESC1 (U4_U_ESC1.8), U_ESC2 (U4_U_ESC2.8), U_ESC3 (U4_U_ESC3.8), U_ESC4 (U4_U_ESC4.8), U_ESC5 (U4_U_ESC5.8), U_ESC6 (U4_U_ESC6.8), U_ESC7 (U4_U_ESC7.8), U_ESC8 (U4_U_ESC8.8)
ESC_SDK1: micro (U1.30), U_ESC1 (U4_U_ESC1.6), U_ESC2 (U4_U_ESC2.6), U_ESC3 (U4_U_ESC3.6), U_ESC4 (U4_U_ESC4.6), U_ESC5 (U4_U_ESC5.6), U_ESC6 (U4_U_ESC6.6), U_ESC7 (U4_U_ESC7.6), U_ESC8 (U4_U_ESC8.6)
ESC_SS1: micro (U1.82), U_ESC1 (U4_U_ESC1.7)
ESC_SS2: micro (U1.83), U_ESC2 (U4_U_ESC2.7)
ESC_SS3: micro (U1.84), U_ESC3 (U4_U_ESC3.7)
ESC_SS4: micro (U1.85), U_ESC4 (U4_U_ESC4.7)
ESC_SS5: micro (U1.86), U_ESC5 (U4_U_ESC5.7)
ESC_SS6: micro (U1.87), U_ESC6 (U4_U_ESC6.7)
ESC_SS7: micro (U1.88), U_ESC7 (U4_U_ESC7.7)
ESC_SS8: micro (U1.55), U_ESC8 (U4_U_ESC8.7)
NetCN3_3: micro (U1.2), debug (CN3.3)
NetCN3_4: micro (U1.1), debug (CN3.4)
NetJP3_2: micro (U1.94), debug (JP3.2 R27.1)
NetR25_1: micro (U1.15), sensors (R25.1 U7.3)
NetR31_1: micro (U1.95), power (R31.1 R33.2)
NetR32_2: micro (U1.96), power (R32.2 R34.2)
NetU1_69: CAN (U3.8), micro (U1.69)
NRST: micro (U1.14), debug (5 pins)
PWM1: micro (U1.40), U_ESC1 (U4_U_ESC1.4)
PWM2: micro (U1.42), U_ESC2 (U4_U_ESC2.4)
PWM3: micro (U1.44), U_ESC3 (U4_U_ESC3.4)
PWM4: micro (U1.45), U_ESC4 (U4_U_ESC4.4)
PWM5: micro (U1.63), U_ESC5 (U4_U_ESC5.4)
PWM6: micro (U1.64), U_ESC6 (U4_U_ESC6.4)
PWM7: micro (U1.65), U_ESC7 (U4_U_ESC7.4)
PWM8: micro (U1.66), U_ESC8 (U4_U_ESC8.4)
SCL: micro (U1.92), sensors (R29.1 U5.8 U6.6 U7.5)
SDA: micro (U1.93), sensors (R30.1 U5.7 U6.1 U7.4)
SPD1: micro (U1.59), U_ESC1 (U4_U_ESC1.3)
SPD2: micro (U1.60), U_ESC2 (U4_U_ESC2.3)
SPD3: micro (U1.61), U_ESC3 (U4_U_ESC3.3)
SPD4: micro (U1.62), U_ESC4 (U4_U_ESC4.3)
SPD5: micro (U1.23), U_ESC5 (U4_U_ESC5.3)
SPD6: micro (U1.24), U_ESC6 (U4_U_ESC6.3)
SPD7: micro (U1.25), U_ESC7 (U4_U_ESC7.3)
SPD8: micro (U1.26), U_ESC8 (U4_U_ESC8.3)
SWCLK: micro (U1.76), debug (CN3.6 R7.1)
SWDIO: micro (U1.72), debug (CN3.7 R8.1)
SWO: micro (U1.89), debug (CN3.8 R9.1)